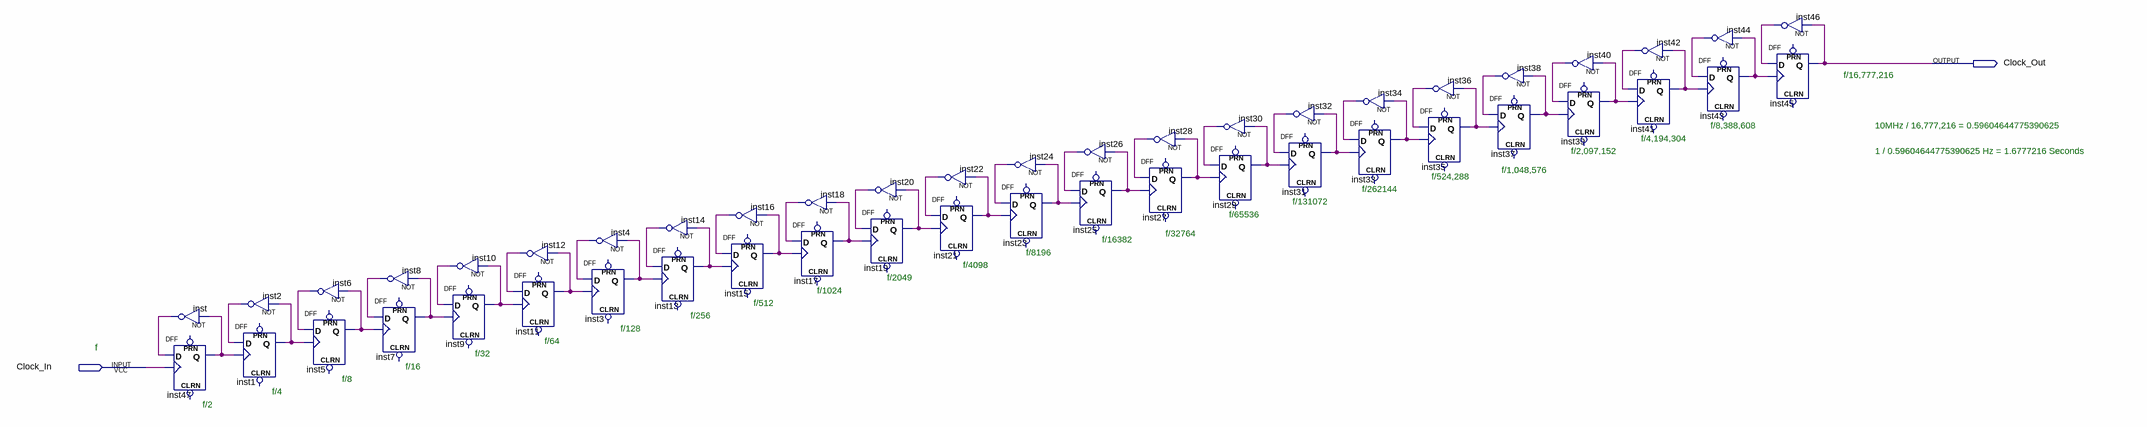
[diagram p0: schematic sheet]
// Quartus schematic Clock_Divider.bdf as structural Verilog: 48 symbols, 2 pins
module Clock_Divider (
  input  Clock_In,
  output Clock_Out
);

  wire inst1_q, inst2_out, inst3_q, inst4_out, inst5_q, inst6_out, inst7_q, inst8_out, inst9_q, inst10_out,
       inst11_q, inst12_out, inst13_q, inst14_out, inst15_q, inst16_out, inst17_q, inst18_out, inst19_q,
       inst20_out, inst21_q, inst22_out, inst23_q, inst24_out, inst25_q, inst26_out, inst27_q, inst28_out,
       inst29_q, inst30_out, inst31_q, inst32_out, inst33_q, inst34_out, inst35_q, inst36_out, inst37_q,
       inst38_out, inst39_q, inst40_out, inst41_q, inst42_out, inst43_q, inst44_out, inst46_out, inst47_q,
       inst_out;

  not inst (inst_out, inst47_q);
  DFF inst47 (.CLK(Clock_In), .D(inst_out), .Q(inst47_q));  // open: CLRN, PRN
  DFF inst1 (.CLK(inst47_q), .D(inst2_out), .Q(inst1_q));  // open: CLRN, PRN
  not inst2 (inst2_out, inst1_q);
  not inst6 (inst6_out, inst5_q);
  DFF inst5 (.CLK(inst1_q), .D(inst6_out), .Q(inst5_q));  // open: CLRN, PRN
  not inst8 (inst8_out, inst7_q);
  DFF inst7 (.CLK(inst5_q), .D(inst8_out), .Q(inst7_q));  // open: CLRN, PRN
  not inst10 (inst10_out, inst9_q);
  DFF inst9 (.CLK(inst7_q), .D(inst10_out), .Q(inst9_q));  // open: CLRN, PRN
  not inst12 (inst12_out, inst11_q);
  DFF inst11 (.CLK(inst9_q), .D(inst12_out), .Q(inst11_q));  // open: CLRN, PRN
  not inst4 (inst4_out, inst3_q);
  DFF inst3 (.CLK(inst11_q), .D(inst4_out), .Q(inst3_q));  // open: CLRN, PRN
  not inst14 (inst14_out, inst13_q);
  DFF inst13 (.CLK(inst3_q), .D(inst14_out), .Q(inst13_q));  // open: CLRN, PRN
  not inst16 (inst16_out, inst15_q);
  DFF inst15 (.CLK(inst13_q), .D(inst16_out), .Q(inst15_q));  // open: CLRN, PRN
  DFF inst17 (.CLK(inst15_q), .D(inst18_out), .Q(inst17_q));  // open: CLRN, PRN
  not inst18 (inst18_out, inst17_q);
  not inst20 (inst20_out, inst19_q);
  DFF inst19 (.CLK(inst17_q), .D(inst20_out), .Q(inst19_q));  // open: CLRN, PRN
  not inst22 (inst22_out, inst21_q);
  DFF inst21 (.CLK(inst19_q), .D(inst22_out), .Q(inst21_q));  // open: CLRN, PRN
  not inst24 (inst24_out, inst23_q);
  DFF inst23 (.CLK(inst21_q), .D(inst24_out), .Q(inst23_q));  // open: CLRN, PRN
  not inst26 (inst26_out, inst25_q);
  DFF inst25 (.CLK(inst23_q), .D(inst26_out), .Q(inst25_q));  // open: CLRN, PRN
  not inst28 (inst28_out, inst27_q);
  DFF inst27 (.CLK(inst25_q), .D(inst28_out), .Q(inst27_q));  // open: CLRN, PRN
  not inst30 (inst30_out, inst29_q);
  DFF inst29 (.CLK(inst27_q), .D(inst30_out), .Q(inst29_q));  // open: CLRN, PRN
  not inst32 (inst32_out, inst31_q);
  DFF inst31 (.CLK(inst29_q), .D(inst32_out), .Q(inst31_q));  // open: CLRN, PRN
  DFF inst33 (.CLK(inst31_q), .D(inst34_out), .Q(inst33_q));  // open: CLRN, PRN
  not inst34 (inst34_out, inst33_q);
  not inst36 (inst36_out, inst35_q);
  DFF inst35 (.CLK(inst33_q), .D(inst36_out), .Q(inst35_q));  // open: CLRN, PRN
  not inst38 (inst38_out, inst37_q);
  DFF inst37 (.CLK(inst35_q), .D(inst38_out), .Q(inst37_q));  // open: CLRN, PRN
  not inst40 (inst40_out, inst39_q);
  DFF inst39 (.CLK(inst37_q), .D(inst40_out), .Q(inst39_q));  // open: CLRN, PRN
  not inst42 (inst42_out, inst41_q);
  DFF inst41 (.CLK(inst39_q), .D(inst42_out), .Q(inst41_q));  // open: CLRN, PRN
  not inst44 (inst44_out, inst43_q);
  DFF inst43 (.CLK(inst41_q), .D(inst44_out), .Q(inst43_q));  // open: CLRN, PRN
  not inst46 (inst46_out, Clock_Out);
  DFF inst45 (.CLK(inst43_q), .D(inst46_out), .Q(Clock_Out));  // open: CLRN, PRN

  // Notes on the sheet:
  //   f/16,777,216
  //   f/8,388,608
  //   10MHz / 16,777,216 = 0.59604644775390625
  //   f/4,194,304
  //   f/2,097,152
  //   1 / 0.59604644775390625 Hz = 1.6777216 Seconds
  //   f/1,048,576
  //   f/524,288
  //   f/262144
  //   f/131072
  //   f/65536
  //   f/32764
  //   f/16382
  //   f/8196
  //   f/4098
  //   f/2049
  //   f/1024
  //   f/512
  //   f/256
  //   f/128
  //   f/64
  //   f
  //   f/32
  //   f/16
  //   f/8
  //   f/4
  //   f/2
endmodule
